# EAGLE design schematic_full (EAGLE 6.2)
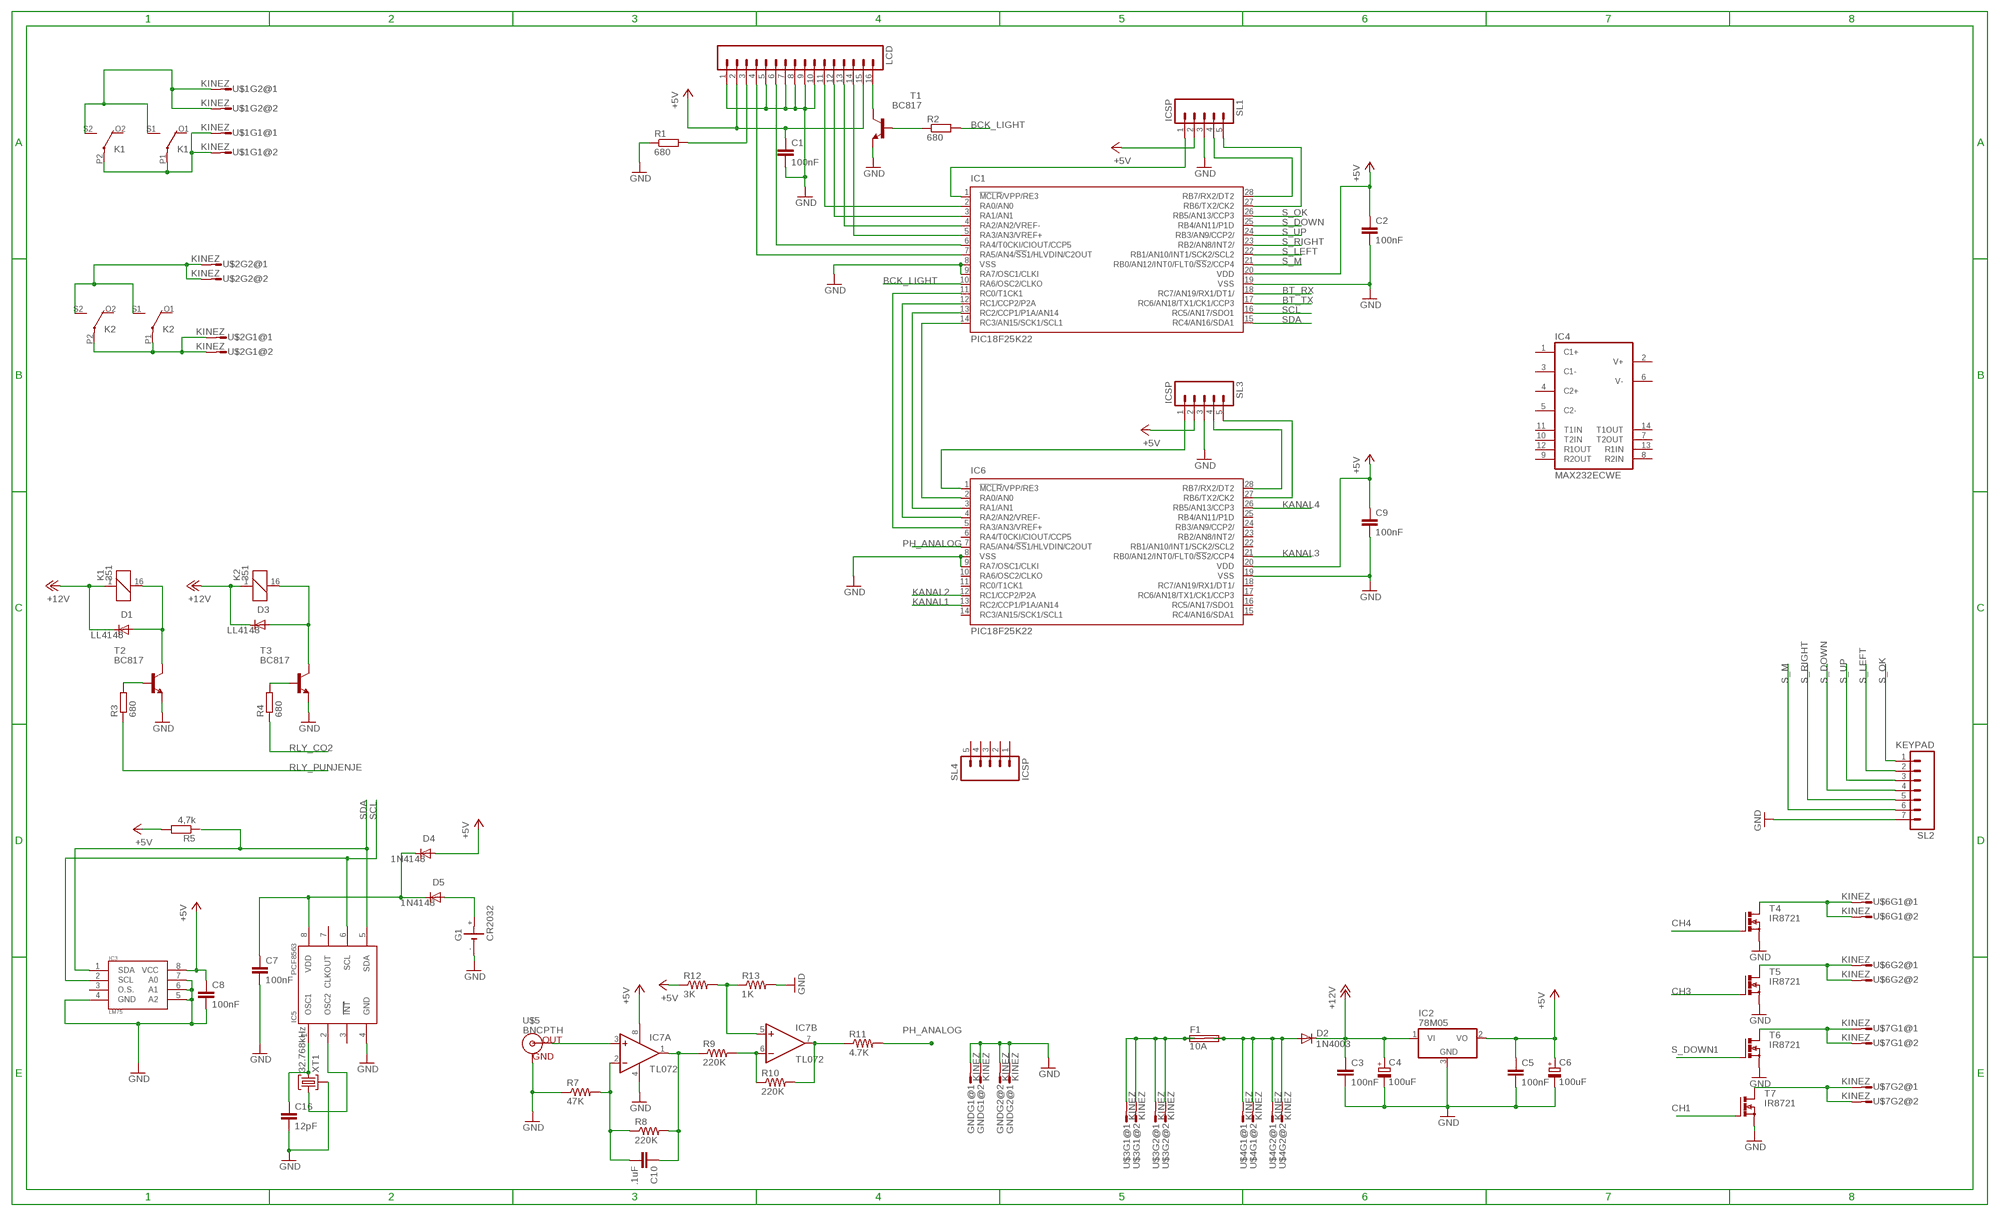
[diagram p0: schematic, sheet 1]

## Parts
C1  100nF  C-EUC0805K  [C0805K]
C2  100nF  C-EUC0805K  [C0805K]
C3  100nF  C-EUC0805K  [C0805K]
C4  100uF  CPOL-EUE2,5-6E  [E2,5-6E]
C5  100nF  C-EUC0805K  [C0805K]
C6  100uF  CPOL-EUE2.5-6  [E2,5-6]
C7  100nF  C-EUC0805K  [C0805K]
C8  100nF  C-EUC0805K  [C0805K]
C9  100nF  C-EUC0805K  [C0805K]
C10  .1uF  CAP0805  [0805]
C16  12pF  C-EUC0805K  [C0805K]
D1  LL4148  DIODE-DO214BA  [DO214BA]
D2  1N4003  1N4933  [DO41-10]
D3  LL4148  DIODE-DO214BA  [DO214BA]
D4  1N4148  DIODE-DO214BA  [DO214BA]
D5  1N4148  DIODE-DO214BA  [DO214BA]
F1  10A  SHK20L  [SHK20L]
G1  CR2032  [CR2032]
GND  KINEZ  [KINEZ]
IC1  PIC18F25K22  PIC18F25K22-E/SS  [SSOP28]
IC2  78M05  7805DT  [TO252]
IC3  LM75  [SO08]
IC4  MAX232ECWE  [SO16L]
IC5  PCF8563  [SO08]
IC6  PIC18F25K22  PIC18F25K22-E/SS  [SSOP28]
IC7  TL072  LM358D  [SO08]
K1  351  [351]
K2  351  [351]
LCD  M16  [16P]
R1  680  R-EU_M0805  [M0805]
R2  680  R-EU_M0805  [M0805]
R3  680  R-EU_M0805  [M0805]
R4  680  R-EU_M0805  [M0805]
R5  4,7k  R-EU_M0805  [M0805]
R7  47K  RESISTOR0805-RES  [0805]
R8  220K  RESISTOR0805-RES  [0805]
R9  220K  RESISTOR0805-RES  [0805]
R10  220K  RESISTOR0805-RES  [0805]
R11  4.7K  RESISTOR0805-RES  [0805]
R12  3K  RESISTOR0805-RES  [0805]
R13  1K  RESISTOR0805-RES  [0805]
SL1  ICSP  M05  [05P]
SL2  KEYPAD  MA07  [07PA]
SL3  ICSP  M05  [05P]
SL4  ICSP  M05  [05P]
T1  BC817  BC817-40SMD  [SOT23-BEC]
T2  BC817  BC817-40SMD  [SOT23-BEC]
T3  BC817  BC817-40SMD  [SOT23-BEC]
T4  IR8721  IRLR120N  [TO252]
T5  IR8721  IRLR120N  [TO252]
T6  IR8721  IRLR120N  [TO252]
T7  IR8721  IRLR120N  [TO252]
U$1  KINEZ  [KINEZ]
U$2  KINEZ  [KINEZ]
U$3  KINEZ  [KINEZ]
U$4  KINEZ  [KINEZ]
U$5  BNCPTH  [BNC]
U$6  KINEZ  [KINEZ]
U$7  KINEZ  [KINEZ]
XT1  32.768kHz  XTMINI  [XTMINI]

## Nets
+5V: C1.1 C2.1 C5.1 C6.+ C8.1 C9.1 D4.A IC1.20(VDD) IC2.2(VO) IC3.8(VCC) IC6.20(VDD) IC7.8(P:V+) LCD.2 LCD.15 R5.2 R12.1 SL1.2 SL3.2
+12V: C3.1 C4.+ D1.C D2.C D3.C IC2.1(VI) K1.1 K2.1
BCK_LIGHT: IC1.10(RA6/OSC2/CLKO) R2.2
BT_RX: IC1.18(RC7/AN19/RX1/DT1/)
BT_TX: IC1.17(RC6/AN18/TX1/CK1/CCP3)
CH1: T7.1(G)
CH3: T5.1(G)
CH4: T4.1(G)
GND: C1.2 C2.2 C3.2 C4.- C5.2 C6.- C7.2 C8.2 C9.2 C16.2 G1.- GND.1 GND.2 GND.3 GND.4 IC1.8(VSS) IC1.9(RA7/OSC1/CLKI) IC1.19(VSS) IC2.3(GND) IC3.4(GND) IC3.5(A2) IC3.6(A1) IC3.7(A0) IC5.4(GND) IC6.8(VSS) IC6.9(RA7/OSC1/CLKI) IC7.4(P:V-) LCD.1 LCD.5 LCD.7 LCD.8 LCD.9 LCD.10 R1.1 R7.1 R13.2 SL1.3 SL2.7 SL3.3 T1.E T2.E T3.E T4.3(S) T5.3(S) T6.3(S) T7.3(S) U$5.GND XT1.P$3
KANAL1: IC6.13(RC2/CCP1/P1A/AN14)
KANAL2: IC6.12(RC1/CCP2/P2A)
KANAL3: IC6.21(RB0/AN12/INT0/FLT0/!SS!2/CCP4)
KANAL4: IC6.26(RB5/AN13/CCP3)
N$1: D5.A G1.+
N$2: K1.S1(2:S) K1.S2(3:S) U$1.3 U$1.4
N$3: K2.P1(2:P) K2.P2(3:P) U$2.1 U$2.2
N$4: F1.1A F1.1B U$3.1 U$3.2 U$3.3 U$3.4
N$5: D2.A F1.2A F1.2B U$4.1 U$4.2 U$4.3 U$4.4
N$6: IC6.27(RB6/TX2/CK2) SL3.5
N$7: IC6.28(RB7/RX2/DT2) SL3.4
N$8: IC5.2(OSC2) XT1.P$1
N$9: IC6.1(!MCLR!/VPP/RE3) SL3.1
N$10: IC1.14(RC3/AN15/SCK1/SCL1) IC6.2(RA0/AN0)
N$11: IC1.13(RC2/CCP1/P1A/AN14) IC6.3(RA1/AN1)
N$12: C7.1 D4.C D5.C IC5.8(VDD)
N$13: IC1.2(RA0/AN0) LCD.11
N$14: IC1.3(RA1/AN1) LCD.12
N$15: IC1.4(RA2/AN2/VREF-) LCD.13
N$16: IC1.5(RA3/AN3/VREF+) LCD.14
N$17: IC1.6(RA4/T0CKI/CIOUT/CCP5) LCD.6
N$18: T5.2(D) U$6.3 U$6.4
N$19: IC1.7(RA5/AN4/!SS!1/HLVDIN/C2OUT) LCD.4
N$20: LCD.3 R1.2
N$21: T6.2(D) U$7.1 U$7.2
N$22: T7.2(D) U$7.3 U$7.4
N$23: D1.A K1.16 T2.C
N$24: C16.1 IC5.1(OSC1) XT1.P$2
N$25: IC1.12(RC1/CCP2/P2A) IC6.4(RA2/AN2/VREF-)
N$26: D3.A K2.16 T3.C
N$27: LCD.16 T1.C
N$28: R4.2 T3.B
N$29: R3.2 T2.B
N$30: K1.P1(2:P) K1.P2(3:P) U$1.1 U$1.2
N$31: IC1.11(RC0/T1CK1) IC6.5(RA3/AN3/VREF+)
N$32: R2.1 T1.B
N$33: IC7.5(B:+IN) R12.2 R13.1
N$34: IC7.7(B:OUT) R10.2 R11.1
N$35: IC1.28(RB7/RX2/DT2) SL1.4
N$36: IC1.27(RB6/TX2/CK2) SL1.5
N$37: IC7.6(B:-IN) R9.2 R10.1
N$38: IC7.3(A:+IN) U$5.S(OUT)
N$39: T4.2(D) U$6.1 U$6.2
N$41: C10.1 IC7.1(A:OUT) R8.2 R9.1
N$42: C10.2 IC7.2(A:-IN) R7.2 R8.1
N$55: IC1.1(!MCLR!/VPP/RE3) SL1.1
PH_ANALOG: IC6.7(RA5/AN4/!SS!1/HLVDIN/C2OUT) R11.2
RLY_CO2: R4.1
RLY_PUNJENJE: R3.1
S_DOWN: IC1.25(RB4/AN11/P1D) SL2.4
S_DOWN1: T6.1(G)
S_LEFT: IC1.22(RB1/AN10/INT1/SCK2/SCL2) SL2.2
S_M: IC1.21(RB0/AN12/INT0/FLT0/!SS!2/CCP4) SL2.6
S_OK: IC1.26(RB5/AN13/CCP3) SL2.1
S_RIGHT: IC1.23(RB2/AN8/INT2/) SL2.5
S_UP: IC1.24(RB3/AN9/CCP2/) SL2.3
SCL: IC1.16(RC5/AN17/SDO1) IC3.2(SCL) IC5.6(SCL)
SDA: IC1.15(RC4/AN16/SDA1) IC3.1(SDA) IC5.5(SDA)
SWITCH2_IN: K2.S1(2:S) K2.S2(3:S) U$2.3 U$2.4
Unconnected: IC3.3(O.S.) IC4.1(C1+) IC4.2(V+) IC4.3(C1-) IC4.4(C2+) IC4.5(C2-) IC4.6(V-) IC4.7(T2OUT) IC4.8(R2IN) IC4.9(R2OUT) IC4.10(T2IN) IC4.11(T1IN) IC4.12(R1OUT) IC4.13(R1IN) IC4.14(T1OUT) IC5.3(INT) IC5.7(CLKOUT) IC6.6(RA4/T0CKI/CIOUT/CCP5) IC6.10(RA6/OSC2/CLKO) IC6.11(RC0/T1CK1) IC6.14(RC3/AN15/SCK1/SCL1) IC6.15(RC4/AN16/SDA1) IC6.16(RC5/AN17/SDO1) IC6.17(RC6/AN18/TX1/CK1/CCP3) IC6.18(RC7/AN19/RX1/DT1/) IC6.22(RB1/AN10/INT1/SCK2/SCL2) IC6.23(RB2/AN8/INT2/) IC6.24(RB3/AN9/CCP2/) IC6.25(RB4/AN11/P1D) K1.O1(2:O) K1.O2(3:O) K2.O1(2:O) K2.O2(3:O) R5.1 SL4.1 SL4.2 SL4.3 SL4.4 SL4.5

## Power pins joined to a net without a drawn wire
GND: IC4.15(GND)
VCC: IC4.16(VCC)
VSS: IC6.19(VSS)

## Library data of the parts
C1-C3 C5 C7-C9 C16 = rcl:C-EU: CAPACITOR, European symbol
C4 C6 = rcl:CPOL-EU: POLARIZED CAPACITOR, European symbol
C10 = SparkysWidgets:CAP: Capacitor Standard 0603 ceramic capacitor, and 0.1" leaded capacitor.
D1 D3-D5 = diode:DIODE-: DIODE
D2 = diode:1N4933: DIODE fast recovery rectifier, 1A
F1 = fuse:SHK20L: FUSE HOLDER 5 x 20 mm, SH contact, SHH1 Schukat, E1073 Buerklin
G1 = battery:CR2032
GND U$1-U$4 U$6 U$7 = con-amp-mt:KINEZ
IC1 IC6 = pic18f25k22:PIC18F25K22: PIC18F25K22 28 pin DIP
IC2 = linear:78*: Positive VOLTAGE REGULATOR Source: http://cache.national.com/ds/LM/LM78L05.pdf http://www.fairchildsemi.com/ds/LM/LM7805.pdf
IC3 = linear:LM75
IC4 = maxim:MAX232ECWE: RS232 TRANSEIVER; MF: MAXIM; MPN: MAX232ECWE+; OC_FARNELL: 9724435; OC_NEWARK: 67K4440
IC5 = philips:PCF8563
IC7 = SparkysWidgets:LM358: OP AMP also LM158; LM258; LM2904 Source: http://cache.national.com/ds/LM/LM158.pdf
K1 K2 = relay:351: RELAY 2 x switch, Omron
LCD = con-amp-quick:M16: AMP QUICK CONNECTOR; OC_FARNELL: unknown; OC_NEWARK: unknown
R1-R5 = resistor:R-EU_: RESISTOR, European symbol
R7-R13 = SparkysWidgets:RESISTOR: Resistor Basic schematic elements and footprints for 0603, 1206, and PTH resistors.
SL1 SL3 SL4 = con-amp-quick:M05: AMP QUICK CONNECTOR
SL2 = con-amp-quick:MA07: AMP QUICK CONNECTOR
T1-T3 = transistor-npn:BC817*: NPN Transistor
T4-T7 = transistor-power:IRLR120N
U$5 = SparkysWidgets:BNC: BNC Connector, Mouser Part# 5227161
XT1 = crystal:XTMINI

## Board
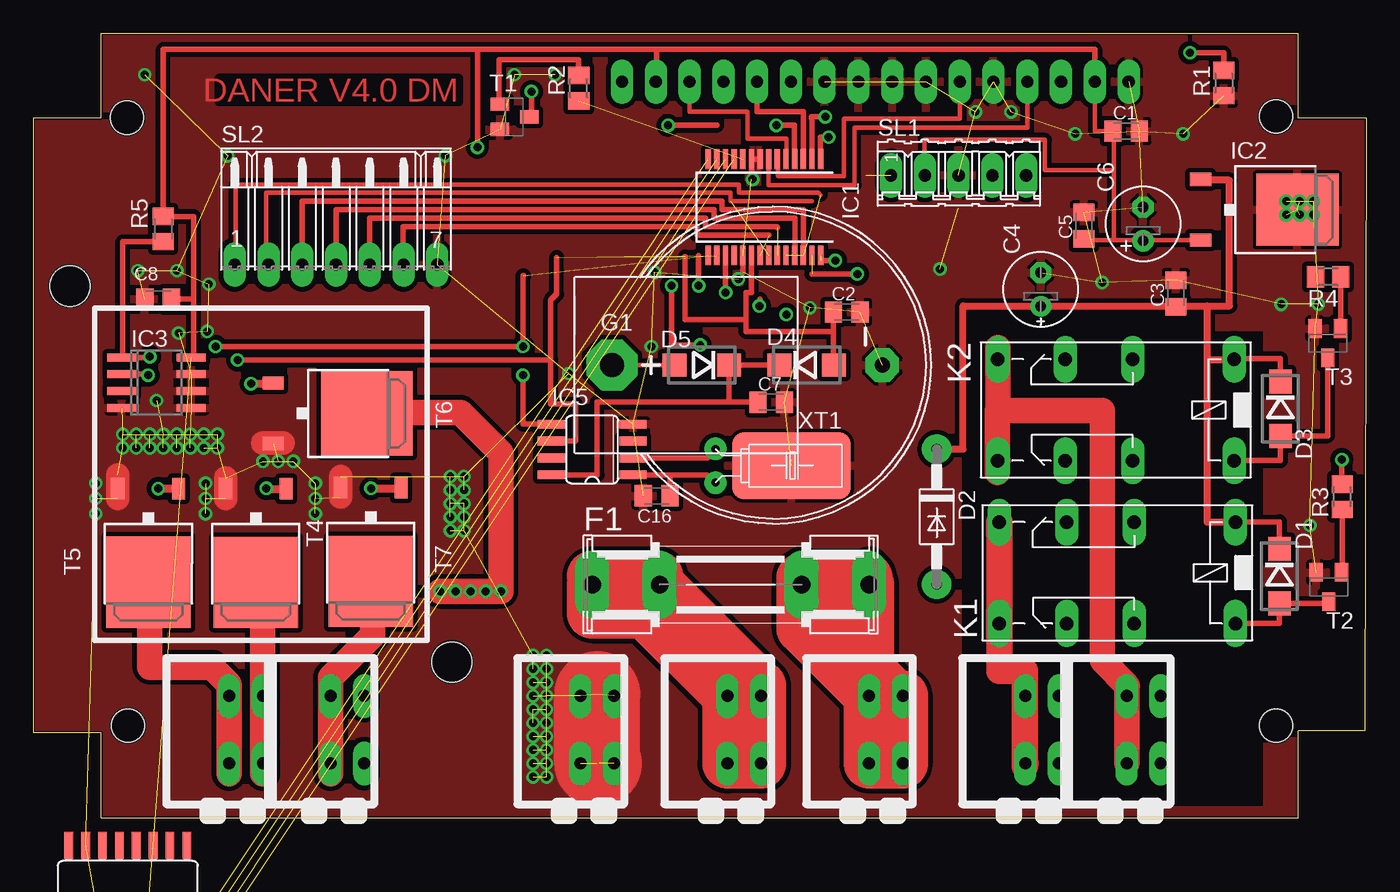
[diagram p1: board, top side]
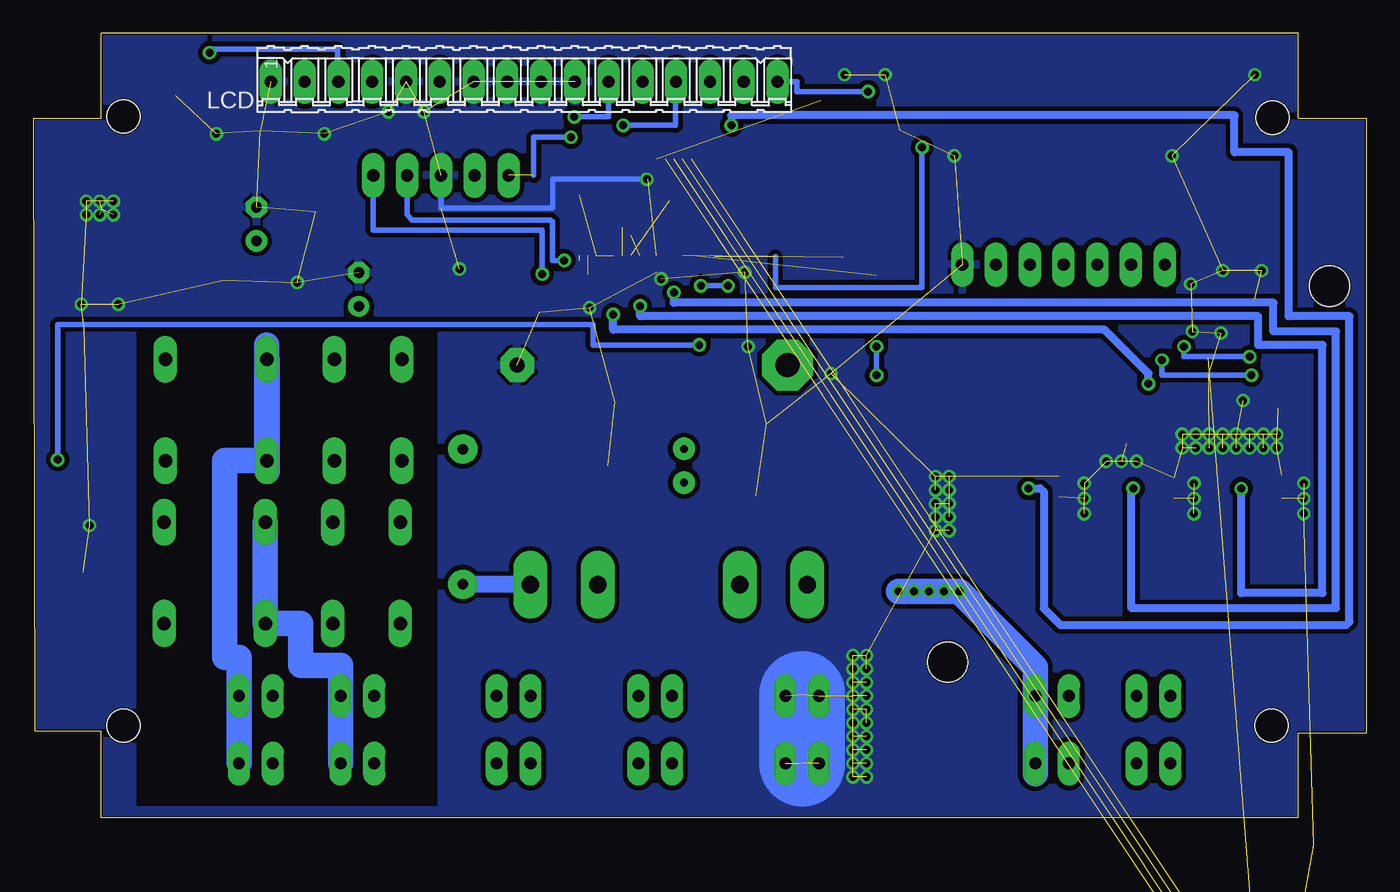
[diagram p2: board, bottom side, seen from below]

Size 100.25 x 59 mm. Coordinates in mm from the lower left corner, seen from the top.
Outline: 5.13,0 95.13,0 95.13,6.51 100.13,6.51 100.25,52.62 95.13,52.62 95.13,59 5.13,59 5.13,52.62 0,52.62 0,6.38 5.13,6.38 5.13,0
Copper layers (1*16): Top 0.035mm / dielectric 1.5mm / Bottom 0.035mm
Design rules: minimum track width 5mil, minimum drill 15mil, track to track 14mil, track to pad 14mil, pad to pad 14mil, via to via 14mil, smd to smd 5mil, copper to edge 5mil, drill to drill 8mil, minimum pad ring 15mil, minimum via ring 8mil, stop-mask expansion 4mil, vias tented up to drill 0mil, thermal gap 10mil
Holes 2.5 mm at 93.48,52.73 7.04,52.65 93.48,6.93 7.12,6.93
Holes 3.02 mm at 2.77,39.98 31.5,11.71
tRestrict: area 69.8,0.9 to 92.5,36.6
bRestrict: area 69.8,0.9 to 92.5,36.6

### Footprints (pad centres in the part's own frame; a part is rotated, then mirrored left to right if it is on the bottom)
C0805K = smd 1.3 x 1.6: 1 -1,0; 2 1,0
E2,5-6E = drill 0.813 pad 1.575: + -1.27,0 | drill 0.813 pad 1.575 octagon: - 1.27,0
E2,5-6 = drill 0.813 pad 1.6: + -1.27,0 | drill 0.813 pad 1.6 octagon: - 1.27,0
0805 = smd 0.984 x 1.143: 1 -0.9,0; 2 0.9,0
DO214BA = smd 1.8 x 1.7: A 2.05,0; C -2.05,0
DO41-10 = drill 0.8 pad 2.184: A 5.08,0; C -5.08,0
SHK20L = drill 1.321 pad 2.54 long: 1A -10.414,0; 1B -5.334,0; 2A 10.414,0; 2B 5.334,0
CR2032 = drill 1.803 pad 3.81 octagon: + 0,9.525 | drill 1.118 pad 2.54 octagon: - 0,-10.795
KINEZ = drill 0.9 long: 1 -2.54,1.27; 2 2.54,1.27; 3 -2.54,-1.27; 4 2.54,-1.27
SSOP28 = smd 0.4 x 1.5: 1 -4.225,-3.625; 2 -3.575,-3.625; 3 -2.925,-3.625; 4 -2.275,-3.625; 5 -1.625,-3.625; 6 -0.975,-3.625; 7 -0.325,-3.625; 8 0.325,-3.625; 9 0.975,-3.625; 10 1.625,-3.625; 11 2.275,-3.625; 12 2.925,-3.625; 13 3.575,-3.625; 14 4.225,-3.625; 15 4.225,3.625; 16 3.575,3.625; 17 2.925,3.625; 18 2.275,3.625; 19 1.625,3.625; 20 0.975,3.625; 21 0.325,3.625; 22 -0.325,3.625; 23 -0.975,3.625; 24 -1.625,3.625; 25 -2.275,3.625; 26 -2.925,3.625; 27 -3.575,3.625; 28 -4.225,3.625
TO252 = smd 1 x 1.6: 1 -2.28,-4.8; 2 2.28,-4.8 | smd 5.4 x 6.2: 3 0,2.5
SO08 = smd 0.6 x 2.2: 1 -1.905,-2.6; 2 -0.635,-2.6; 3 0.635,-2.6; 4 1.905,-2.6; 5 1.905,2.6; 6 0.635,2.6; 7 -0.635,2.6; 8 -1.905,2.6
SO16L = smd 0.66 x 2.032: 1 -4.445,-4.902; 2 -3.175,-4.902; 3 -1.905,-4.902; 4 -0.635,-4.902; 5 0.635,-4.902; 6 1.905,-4.902; 7 3.175,-4.902; 8 4.445,-4.902; 9 4.445,4.902; 10 3.175,4.902; 11 1.905,4.902; 12 0.635,4.902; 13 -0.635,4.902; 14 -1.905,4.902; 15 -3.175,4.902; 16 -4.445,4.902
SO08' = smd 0.66 x 2.032: 1 -1.905,-3.073; 2 -0.635,-3.073; 3 0.635,-3.073; 4 1.905,-3.073; 5 1.905,3.073; 6 0.635,3.073; 7 -0.635,3.073; 8 -1.905,3.073
SO08'' = smd 0.6 x 2.286: 1 -1.905,-2.6; 2 -0.635,-2.6; 3 0.635,-2.6; 4 1.905,-2.6; 5 1.905,2.6; 6 0.635,2.6; 7 -0.635,2.6; 8 -1.905,2.6
351 = drill 1.016 long: 1 -3.81,-3.81; 16 -3.81,3.81; O1 8.89,-3.81; O2 8.89,3.81; P1 3.81,-3.81; P2 3.81,3.81; S1 13.97,-3.81; S2 13.97,3.81
16P = drill 0.914 long: 1 -19.05,0; 2 -16.51,0; 3 -13.97,0; 4 -11.43,0; 5 -8.89,0; 6 -6.35,0; 7 -3.81,0; 8 -1.27,0; 9 1.27,0; 10 3.81,0; 11 6.35,0; 12 8.89,0; 13 11.43,0; 14 13.97,0; 15 16.51,0; 16 19.05,0
M0805 = smd 1.3 x 1.6: 1 -0.95,0; 2 0.95,0
05P = drill 0.914 long: 1 -5.08,0; 2 -2.54,0; 3 0,0; 4 2.54,0; 5 5.08,0
07PA = drill 0.914 long: 1 -7.62,0; 2 -5.08,0; 3 -2.54,0; 4 0,0; 5 2.54,0; 6 5.08,0; 7 7.62,0
SOT23-BEC = smd 1 x 1.4: B -0.95,-1.1; C 0,1.1; E 0.95,-1.1
TO252' = smd 1 x 1.6: 1 -2.28,-4.8; 3 2.28,-4.8 | smd 6.35 x 6.858: 2 0,2.246
BNC = drill 2.2: 3 -5.08,5.08; 4 5.08,5.08 | drill 0.8 long: GND -2.54,0; S 0,0
XTMINI = drill 0.6 pad 1.676: P$1 -1.27,-1.27; P$2 1.27,-1.27 | smd 5.08 x 8.89: P$3 0,4.445

### Placement (x,y rotation side)
C1  82.19,51.64 0 top
C2  61.19,38.02 0 top
C3  85.93,39.42 90 top
C4  75.77,39.73 90 top
C5  79.02,44.53 90 top
C6  83.46,44.65 90 top
C7  55.5,31.24 0 top
C8  9.4,38.99 180 top
C9  2.03,-34.29 0 top  (outside the outline)
C10  19.18,-75.56 0 top  (outside the outline)
C16  46.89,24.21 180 top
D1  93.73,18.16 270 top
D2  67.94,22.63 270 top
D3  93.8,30.76 270 top
D4  58.17,34.04 0 top
D5  50.29,34.04 180 top
F1  52.45,17.53 0 top
G1  53.06,34.04 90 top
GND  42.42,6.6 270 top
IC1  54.99,45.91 180 top
IC2  92.58,45.72 270 top
IC3  9.27,32.72 270 top
IC4  7.11,-6.99 0 top
IC5  PCF8563  [SO08']  42.04,27.69 90 top
IC6  7.11,-17.78 0 top  (outside the outline)
IC7  TL072  [SO08'']  19.81,-41.27 0 top  (outside the outline)
K1  86.61,18.41 180 top
K2  86.51,30.66 180 top
LCD  63.33,55.36 0 bottom
R1  89.53,55.24 90 top
R2  41.02,54.86 270 top
R3  98.45,24.13 270 top
R4  97.39,40.67 0 top
R5  9.78,44.27 90 top
R7  22.35,-75.56 0 top  (outside the outline)
R8  25.53,-75.56 0 top  (outside the outline)
R9  1.4,-83.19 0 top  (outside the outline)
R10  4.57,-83.19 0 top  (outside the outline)
R11  7.75,-83.19 0 top  (outside the outline)
R12  10.92,-83.19 0 top  (outside the outline)
R13  14.1,-83.19 0 top  (outside the outline)
SL1  69.6,48.31 0 top
SL2  22.77,41.59 0 top
SL3  6.48,-27.3 0 top  (outside the outline)
SL4  6.48,-90.17 0 top  (outside the outline)
T1  36.2,52.7 270 top
T2  97.43,17.35 180 top
T3  97.36,35.69 180 top
T4  IR8721  [TO252']  16.74,19.93 180 top
T5  IR8721  [TO252']  8.66,19.95 180 top
T6  IR8721  [TO252']  22.85,30.4 270 top
T7  IR8721  [TO252']  25.38,20.01 180 top
U$1  75.87,6.6 270 top
U$2  83.52,6.6 270 top
U$3  53.47,6.6 270 top
U$4  64.13,6.6 270 top
U$5  7.75,-71.12 0 top  (outside the outline)
U$6  16,6.6 270 top
U$7  23.62,6.6 270 top
XT1  52.58,26.47 270 top

### Tracks (layer width: path | path; a pad name or v marks a point on that pad's centre or on a via)
+5V  (via drill 0.6)  (6 unrouted)
  Top 0.305: C6.+ 83.51,43.38 83.57,43.44
  Top 0.356: 81.28,43.44 79.02,43.44 C5.1 | 81.28,43.44 83.57,43.44 IC2.2 | 79.83,57.84 LCD.2 79.84,51.64 C1.1 81.28,51.64 81.28,48.69 | SL1.2 67.03,48.31 67.03,50.98 76.1,50.98 76.1,48.69 81.28,48.69 | 81.28,48.69 81.28,43.44
  Top 0.406: LCD.15 46.86,55.36 46.86,57.78 | 46.86,57.78 79.84,57.78 LCD.2 | 33.4,57.78 9.78,57.78 R5.2 12.07,45.21 12.07,38.99 | 33.4,57.78 46.86,57.78 | IC3.8 12.07,34.62 12.07,38.99 | 12.07,38.99 C8.1 | 33.4,57.78 v33.4,50.42 | 49.02,42.19 49.02,37.47 53.59,37.47 | 53.59,37.47 53.59,39.5 54.02,39.5 IC1.20 | D4.A 60.2,34.04 60.2,36.58 | 60.2,36.58 53.59,36.58 53.59,37.47 | C2.1 60.2,36.58
  Bottom 0.406: 44.45,42.19 44.45,39.88 33.4,39.88 v33.4,50.42
+12V
  Top 0.305: C3.1 85.98,38.48 | C4.+ 75.72,38.46 75.69,38.48
  Top 0.406: D1.C 93.73,22.25 90.42,22.25 K1.1 | D3.C 93.8,34.52 90.32,34.52 K2.1
  Top 0.508: K1.1 88.29,22.23 88.29,34.44 | 88.29,34.44 90.32,34.44 K2.1 | 88.29,34.44 88.29,38.48 | IC2.1 87.78,47.93 89.97,47.93 89.97,38.48 88.29,38.48 | D2.C 69.93,27.71 69.93,38.48 75.69,38.48 85.98,38.48 88.29,38.48
BCK_LIGHT  (1 unrouted)
CH1  (via drill 0.6)
  Top 0.406: v47.75,52.07 51.41,52.07
  Top 0.61: v25.4,24.77 27.61,24.77 T7.1
  Bottom 0.61: v47.75,52.07 47.75,52.83 9.91,52.83 9.91,50.04 5.84,50.04 5.84,37.72 1.27,37.72 1.27,14.73 1.52,14.48 22.99,14.48 24.26,15.75 24.26,24.51 24.51,24.77 v25.4,24.77
CH3  (via drill 0.6)
  Top 0.406: v54.61,38.48 54.66,38.99
  Top 0.61: 10.92,24.77 T5.1 v9.4,24.75
  Bottom 0.61: v9.4,24.75 9.4,16.89 3.3,16.89 3.3,35.56 8.13,35.56 8.13,37.72 54.61,37.72 v54.61,38.48
CH4  (via drill 0.6)
  Top 0.406: v17.53,24.77 17.53,24.73 | v52.07,39.5 52.07,42.28
  Top 0.61: 17.53,24.73 T4.1
  Bottom 0.406: 17.65,24.77 v17.53,24.77
  Bottom 0.61: 17.65,24.77 17.65,15.75 2.29,15.75 2.29,36.58 6.98,36.58 6.98,38.73 52.07,38.73 v52.07,39.5
GND  (via drill 0.6)  (136 unrouted)
  Top 0.406: IC1.8 IC1.9 54.02,48.01 v54.1,48.01 | IC1.19 53.37,41.05 v53.04,40.51
  Top 0.813: T5.3 6.38,25.5 6.35,25.53 | 14.48,24 14.48,24.71 T4.3 | T6.3 18.72,28.12 18.8,28.19 | 23.11,24.13 23.11,24.8 T7.3
  Top 1.778: 6.35,25.78 6.35,25.53 6.35,24 | 14.48,25.53 14.48,24 | 23.11,25.65 23.11,24.13 | 17.27,28.19 18.8,28.19
  Top 6.452: 42.55,4.06 42.42,4.06 42.42,9.27
  Bottom 0.406: SL1.3 69.6,45.85 61.21,45.85 61.21,48.01 v54.1,48.01
  Bottom 6.452: 42.42,4.06 42.42,9.27
  other vias: 68.2,41.27 9.27,31.37 10.92,36.45 13.21,40.13 10.79,41.15 13.08,36.58 12.95,25.15 12.95,24 12.95,22.86 21.21,25.15 21.21,24 21.21,22.86 4.7,25.15 4.7,24 4.7,22.86 19.56,26.8 18.41,26.8 17.27,26.8 6.73,28.83 7.75,28.83 8.76,28.83 9.78,28.83 11.81,28.83 12.83,28.83 13.84,28.83 13.84,27.81 12.83,27.81 11.81,27.81 10.79,27.81 9.78,27.81 8.76,27.81 7.75,27.81 6.73,27.81 10.79,28.83 38.61,12.19 38.61,10.16 38.61,9.14 38.61,8.13 37.59,8.13 37.59,9.14 37.59,10.16 37.59,11.18 37.59,12.19 38.61,7.11 38.61,5.08 38.61,4.06 38.61,3.05 37.59,3.05 37.59,4.06 37.59,5.08 37.59,6.1 37.59,7.11 38.61,6.1 38.61,11.18 31.37,21.59 31.37,23.62 31.37,24.64 31.37,25.65 32.39,25.65 32.39,24.64 32.39,23.62 32.39,22.61 32.39,21.59 31.37,22.61 93.85,38.61 86.49,51.44 7.87,41.15 80.39,40.26 8.38,55.88 14.61,49.78 30.99,49.78 78.36,51.44 70.87,53.09 73.53,53.09 39.24,55.88 96.27,45.34 95.25,45.34 94.23,45.34 94.23,46.35 95.25,46.35 96.27,46.35 46.48,35.43 40.26,33.4 46.74,41.02 58.42,38.35 36.2,55.88 96.01,21.97 96.65,38.61
  pour Bottom: 5.08,0 95.12,0 95.12,6.62 100.08,6.49 100.2,52.56 95,52.56 95.12,58.93 5.08,58.93 5.21,52.56 0.13,52.56 0.13,6.37 5.08,6.37
  pour Top: 5.08,0 95.12,0 95.12,6.62 100.08,6.49 100.2,52.56 95,52.56 95.12,58.93 5.08,58.93 5.21,52.56 0.13,52.56 0.13,6.37 5.08,6.37
N$1
  Top 0.356: G1.+ D5.A
N$2
  Top 0.61: U$1.3 74.57,9.14
  Top 2.007: U$1.4 74.57,3.86 74.57,9.14 74.57,11.05 72.64,11.05 K1.S2 K1.S1
N$3
  Bottom 1.93: 82.7,35.56 82.68,33.66 | 82.68,26.04 82.68,33.66 | 82.68,33.66 82.68,34.47 K2.P1 K2.P2 85.85,26.85 85.85,12.06 84.78,12.06 U$2.1 U$2.2
N$4
  Top 1.93: F1.1A 42.29,17.53 42.42,17.4 42.42,18.03 42.55,18.16
  Top 3.81: F1.1B 54.74,9.91 U$3.1 U$3.2 U$3.4 U$3.3 45.97,15.37 42.04,15.37 F1.1A | 42.04,18.16 42.55,18.16 46.99,18.16
N$5
  Top 0.61: F1.2B 57.79,18.03
  Top 3.81: U$4.3 U$4.4 U$4.2 U$4.1 64.9,9.14 | U$4.3 64.9,9.14 | U$4.3 57.79,14.22 57.79,15.62 | 57.79,15.62 F1.2B | F1.2A 62.87,11.18 64.9,9.14 | 57.79,18.03 62.74,18.03 | 57.79,15.62 62.74,15.62
  Bottom 1.27: F1.2A 67.92,17.53 D2.A
N$6  (1 unrouted)
N$7  (1 unrouted)
N$8
  Top 0.406: XT1.P$1 51.31,27.69 50.67,27.05 IC5.2
N$9  (1 unrouted)
N$10  (1 unrouted)
N$11  (1 unrouted)
N$12
  Top 0.406: D4.C D5.C 52.32,34.04 52.32,31.24 | 52.32,31.24 42.42,31.24 42.42,25.78 IC5.8 | C7.1 52.32,31.24
N$13  (via drill 0.6)
  Top 0.406: IC1.2 58.57,52.31 58.55,52.7 v59.56,52.7
  Bottom 0.406: v59.56,52.7 56.98,52.7 LCD.11
N$14
  Top 0.406: IC1.3 57.91,53.09 54.44,53.09 LCD.12
N$15  (via drill 0.6)
  Top 0.406: v55.88,52.07 57.27,52.07 IC1.4
  Bottom 0.406: LCD.13 51.94,55.36 51.94,52.07 v55.88,52.07
N$16
  Top 0.356: IC1.5 56.64,49.54 56.64,51.05 53.72,51.05 53.72,53.09 49.36,53.09 LCD.14
N$17
  Top 0.356: IC1.6 56.01,49.54 56.01,48.26 60.96,48.26 60.96,52.58 69.68,52.58 LCD.6
N$18
  Top 1.93: 14.73,3.3 U$6.4 U$6.3 14.73,9.65 14.73,10.03 13.46,11.3 8.76,11.3 8.76,17.02 8.66,17.02 T5.2
N$19
  Top 0.356: IC1.7 55.3,49.54 55.3,47.57 61.77,47.57 61.77,51.89 74.76,51.89 LCD.4
N$20  (via drill 0.6)
  Top 0.406: v86.99,57.53 89.53,57.53 R1.2
  Bottom 0.406: LCD.3 77.34,55.36 77.34,57.78 86.74,57.78 v86.99,57.53
N$21  (via drill 0.6)
  Top 1.93: v35.18,17.02 35.18,27.43 32.13,30.48 26.04,30.48 25.91,30.61 25.3,30.61 T6.2 | v30.61,17.02 v31.75,17.02 v32.89,17.02 v34.04,17.02 34.93,17.02 35.05,17.14
  Bottom 1.93: U$7.2 24.89,5.08 | U$7.2 24.89,3.3 | U$7.2 U$7.1 24.89,10.67 24.89,11.3 v30.61,17.02 v31.75,17.02 v32.89,17.02 v34.04,17.02 v35.18,17.02
N$22
  Top 1.93: 22.35,3.3 U$7.4 U$7.3 22.35,9.65 22.35,10.54 25.53,13.72 25.53,17.62 T7.2
N$23
  Top 0.406: K1.16 93.73,14.61 D1.A 97.43,16.11 T2.C
N$24
  Top 0.406: XT1.P$2 51.26,25.2 50.67,25.78 49.53,25.78 | 49.53,25.78 IC5.1 | C16.1 47.89,25.77 49.53,25.78
N$25  (1 unrouted)
N$26
  Top 0.406: K2.16 93.8,26.85 D3.A 97.36,28.71 T3.C
N$27  (via drill 0.6)
  Top 0.406: T1.C 37.47,52.7 v37.47,54.61
  Bottom 0.406: v37.47,54.61 42.8,54.61 42.8,55.37 44.28,55.37 LCD.16
N$28
  Top 0.406: T3.B 98.34,36.79 R4.2
N$29
  Top 0.406: T2.B 98.45,18.57 R3.2
N$30
  Bottom 1.93: U$1.2 U$1.1 77.14,9.53 77.14,11.43 80.14,11.43 80.14,14.61 K1.P2 K1.P1
N$31  (1 unrouted)
N$32
  Top 0.406: T1.B 35.05,53.66 35.05,57.02 41.02,57.02 R2.1
N$33  (2 unrouted)
N$34  (2 unrouted)
N$35  (via drill 0.6)  (1 unrouted)
  Top 0.406: 59.22,41.91 v60.33,41.91
  Bottom 0.406: v60.33,41.91 61.21,41.91 61.21,44.83 61.34,44.96 71.75,44.96 72.14,45.34 SL1.4
N$36  (via drill 0.6)  (1 unrouted)
  Top 0.406: 58.57,40.89 v61.98,40.89
  Bottom 0.406: SL1.5 74.68,44.2 61.98,44.2 v61.98,40.89
N$37  (2 unrouted)
N$38  (1 unrouted)
N$39
  Top 1.93: U$6.2 17.27,5.59 | U$6.2 17.27,3.3 | U$6.2 U$6.1 17.27,15.75 arc-90 17.14,15.88 17.14,16.89 arc-90 16.74,17.3 T4.2
N$41  (3 unrouted)
N$42  (3 unrouted)
N$55  (via drill 0.6)  (1 unrouted)
  Top 0.356: IC1.1
  Top 0.406: v59.82,51.18 59.22,51.18 IC1.1
  Bottom 0.406: 62.61,48.31 62.61,51.18 v59.82,51.18
PH_ANALOG  (1 unrouted)
RLY_PUNJENJE  (via drill 0.6)
  Top 0.406: 50.04,42.29 50.04,42.16 v50.04,40.01 | v50.16,35.56 48.01,35.56 v48.01,40.01 | 98.55,25.02 R3.1 98.42,25.27 v98.42,26.92
  Bottom 0.406: v98.42,26.92 98.42,37.08 58.17,37.08 58.17,35.56 v50.16,35.56 | v50.04,40.01 v48.01,40.01
S_DOWN  (1 unrouted)
  Top 0.406: IC1.25 57.28,45.09 51.18,45.09 51.18,45.72 22.77,45.72 SL2.4
  Top 0.61: 22.73,41.56 SL2.4
S_DOWN1  (via drill 0.6)
  Top 0.406: 18.03,32.68 18.16,32.68 | 56.62,37.87 v56.64,37.85
  Top 0.61: 18.03,32.68 18.04,32.68 T6.1 18,32.64 v16.38,32.64
  Bottom 0.61: v56.64,37.85 56.64,36.7 19.68,36.7 16.38,33.4 v16.38,32.64
S_LEFT  (1 unrouted)
  Top 0.356: SL2.2 17.53,41.59 17.53,46.99 52.45,46.99 52.45,46.35 58.57,46.35
  Top 0.61: 17.63,41.53 SL2.2
S_M  (1 unrouted)
  Top 0.406: SL2.6 27.81,41.59 27.81,44.45 49.91,44.45 49.91,43.81 55.32,43.81
  Top 0.61: 27.81,41.56 SL2.6
S_OK  (1 unrouted)
  Top 0.356: SL2.1 15.24,41.59 15.24,47.62 53.09,47.62 53.09,46.99 59.05,46.99 59.22,46.83
  Top 0.61: 15.11,41.56 SL2.1
S_RIGHT  (1 unrouted)
  Top 0.406: 55.97,44.37 55.88,44.45 50.55,44.45 50.55,45.09 25.31,45.09 SL2.5
  Top 0.61: 25.27,41.56 SL2.5
S_UP  (1 unrouted)
  Top 0.406: 57.91,42.29 57.91,45.72 51.82,45.72 51.82,46.35 20.23,46.35 SL2.3
  Top 0.61: 20.19,41.56 SL2.3
SCL  (via drill 0.6)  (1 unrouted)
  Top 0.406: IC3.2 8.64,33.35 v8.64,33.27 | v15.37,34.42 38.91,34.42 | IC5.6 40.77,28.32 40.77,31.11 38.91,31.11 38.91,34.42 | 38.91,34.42 38.91,38.91 39.37,39.37 39.37,42.14
  Bottom 0.406: v8.64,33.27 15.37,33.27 v15.37,34.42
SDA  (via drill 0.6)  (1 unrouted)
  Top 0.406: 38.99,29.59 IC5.5 36.83,29.59 v36.83,33.27 | 9.78,43.31 6.73,43.31 6.73,34.62 IC3.1 8.71,34.62 v8.76,34.67 | 36.88,40.77 36.83,40.77 v36.83,35.43 v13.72,35.43
  Bottom 0.406: v8.76,34.67 13.72,34.67 v13.72,35.43 | v36.83,35.43 v36.83,33.27
SWITCH2_IN
  Top 1.93: U$2.4 U$2.3 82.24,9.86 82.3,9.91 80.39,11.81 80.39,30.61 72.54,30.61 | 72.54,30.61 72.52,30.61 72.52,26.85 | 72.52,26.85 K2.S2 | 72.54,30.61 K2.S1 72.54,35.36 | 72.52,26.85 72.52,25.96

### Text on the board
Top: DANER V4.0 DM